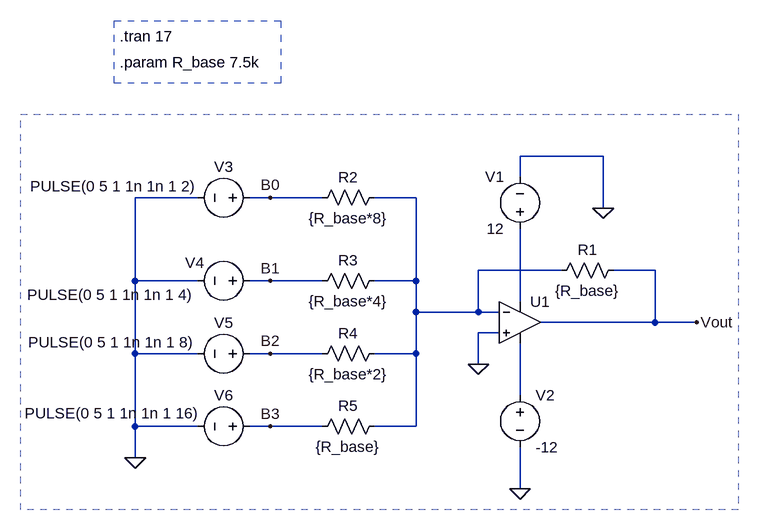
[diagram p0: schematic Draft2.asc]
Draft2.asc, the LTspice schematic file:
Version 4.1
SHEET 1 880 680
WIRE 336 -80 208 -80
WIRE 208 -48 208 -80
WIRE -288 -16 -384 -16
WIRE -176 -16 -208 -16
WIRE -96 -16 -176 -16
WIRE 48 -16 -16 -16
WIRE 336 0 336 -80
WIRE 272 96 144 96
WIRE 416 96 352 96
WIRE -384 112 -384 -16
WIRE -288 112 -384 112
WIRE -176 112 -208 112
WIRE -96 112 -176 112
WIRE 48 112 48 -16
WIRE 48 112 -16 112
WIRE 208 144 208 32
WIRE 48 160 48 112
WIRE 144 160 144 96
WIRE 144 160 48 160
WIRE 176 160 144 160
WIRE 416 176 416 96
WIRE 416 176 240 176
WIRE 480 176 416 176
WIRE 176 192 144 192
WIRE -384 224 -384 112
WIRE -288 224 -384 224
WIRE -176 224 -208 224
WIRE -96 224 -176 224
WIRE 48 224 48 160
WIRE 48 224 -16 224
WIRE 144 240 144 192
WIRE 208 288 208 208
WIRE -384 336 -384 224
WIRE -288 336 -384 336
WIRE -176 336 -208 336
WIRE -96 336 -176 336
WIRE 48 336 48 224
WIRE 48 336 -16 336
WIRE -384 384 -384 336
WIRE 208 432 208 368
FLAG 208 432 0
FLAG 336 0 0
FLAG 144 240 0
FLAG 480 176 Vout
FLAG -384 384 0
FLAG -176 -16 B0
FLAG -176 112 B1
FLAG -176 224 B2
FLAG -176 336 B3
SYMBOL OpAmps\\UniversalOpAmp2 208 176 R0
SYMATTR InstName U1
SYMBOL voltage 208 48 R180
WINDOW 0 24 96 Left 2
WINDOW 3 24 16 Left 2
WINDOW 123 0 0 Left 0
WINDOW 39 0 0 Left 0
SYMATTR InstName V1
SYMATTR Value 12
SYMBOL voltage 208 272 R0
WINDOW 123 0 0 Left 0
WINDOW 39 0 0 Left 0
SYMATTR InstName V2
SYMATTR Value -12
SYMBOL res 368 80 R90
WINDOW 0 0 56 VBottom 2
WINDOW 3 32 56 VTop 2
SYMATTR InstName R1
SYMATTR Value {R_base}
SYMBOL res 0 -32 R90
WINDOW 0 0 56 VBottom 2
WINDOW 3 32 56 VTop 2
SYMATTR InstName R2
SYMATTR Value {R_base*8}
SYMBOL res 0 96 R90
WINDOW 0 0 56 VBottom 2
WINDOW 3 32 56 VTop 2
SYMATTR InstName R3
SYMATTR Value {R_base*4}
SYMBOL res 0 208 R90
WINDOW 0 0 56 VBottom 2
WINDOW 3 32 56 VTop 2
SYMATTR InstName R4
SYMATTR Value {R_base*2}
SYMBOL res 0 320 R90
WINDOW 0 0 56 VBottom 2
WINDOW 3 32 56 VTop 2
SYMATTR InstName R5
SYMATTR Value {R_base}
SYMBOL voltage -192 -16 R90
WINDOW 0 -32 56 VBottom 2
WINDOW 3 -33 225 VTop 2
WINDOW 123 0 0 Left 0
WINDOW 39 0 0 Left 0
SYMATTR InstName V3
SYMATTR Value PULSE(0 5 1 1n 1n 1 2)
SYMBOL voltage -192 112 R90
WINDOW 0 -12 100 VBottom 2
WINDOW 3 6 230 VTop 2
WINDOW 123 0 0 Left 0
WINDOW 39 0 0 Left 0
SYMATTR InstName V4
SYMATTR Value PULSE(0 5 1 1n 1n 1 4)
SYMBOL voltage -192 224 R90
WINDOW 0 -32 56 VBottom 2
WINDOW 3 -33 228 VTop 2
WINDOW 123 0 0 Left 0
WINDOW 39 0 0 Left 0
SYMATTR InstName V5
SYMATTR Value PULSE(0 5 1 1n 1n 1 8)
SYMBOL voltage -192 336 R90
WINDOW 0 -32 56 VBottom 2
WINDOW 3 -36 227 VTop 2
WINDOW 123 0 0 Left 0
WINDOW 39 0 0 Left 0
SYMATTR InstName V6
SYMATTR Value PULSE(0 5 1 1n 1n 1 16)
TEXT -408 -224 Left 2 !.param R_base 7.5k
TEXT -408 -264 Left 2 !.tran 17
RECTANGLE Normal -160 -192 -416 -288 3
RECTANGLE Normal 544 464 -560 -144 2

The netlist it stands for:
* Draft2.asc
X§U1 0 N001 N002 N003 Vout level2 Avol=1Meg GBW=10Meg Slew=10Meg Ilimit=25m Rail=0 Vos=0 En=0 Enk=0 In=0 Ink=0 Rin=500Meg  ; pins In+ In- V+ V- OUT
V1 N002 0 12
V2 N003 0 -12
R1 Vout N001 {R_base}
R2 N001 B0 {R_base*8}
R3 N001 B1 {R_base*4}
R4 N001 B2 {R_base*2}
R5 N001 B3 {R_base}
V3 B0 0 PULSE(0 5 1 1n 1n 1 2)
V4 B1 0 PULSE(0 5 1 1n 1n 1 4)
V5 B2 0 PULSE(0 5 1 1n 1n 1 8)
V6 B3 0 PULSE(0 5 1 1n 1n 1 16)
.param R_base 7.5k
.tran 17
.lib UniversalOpAmp2.lib
.backanno
.end